# EAGLE design skull (EAGLE 5.10)
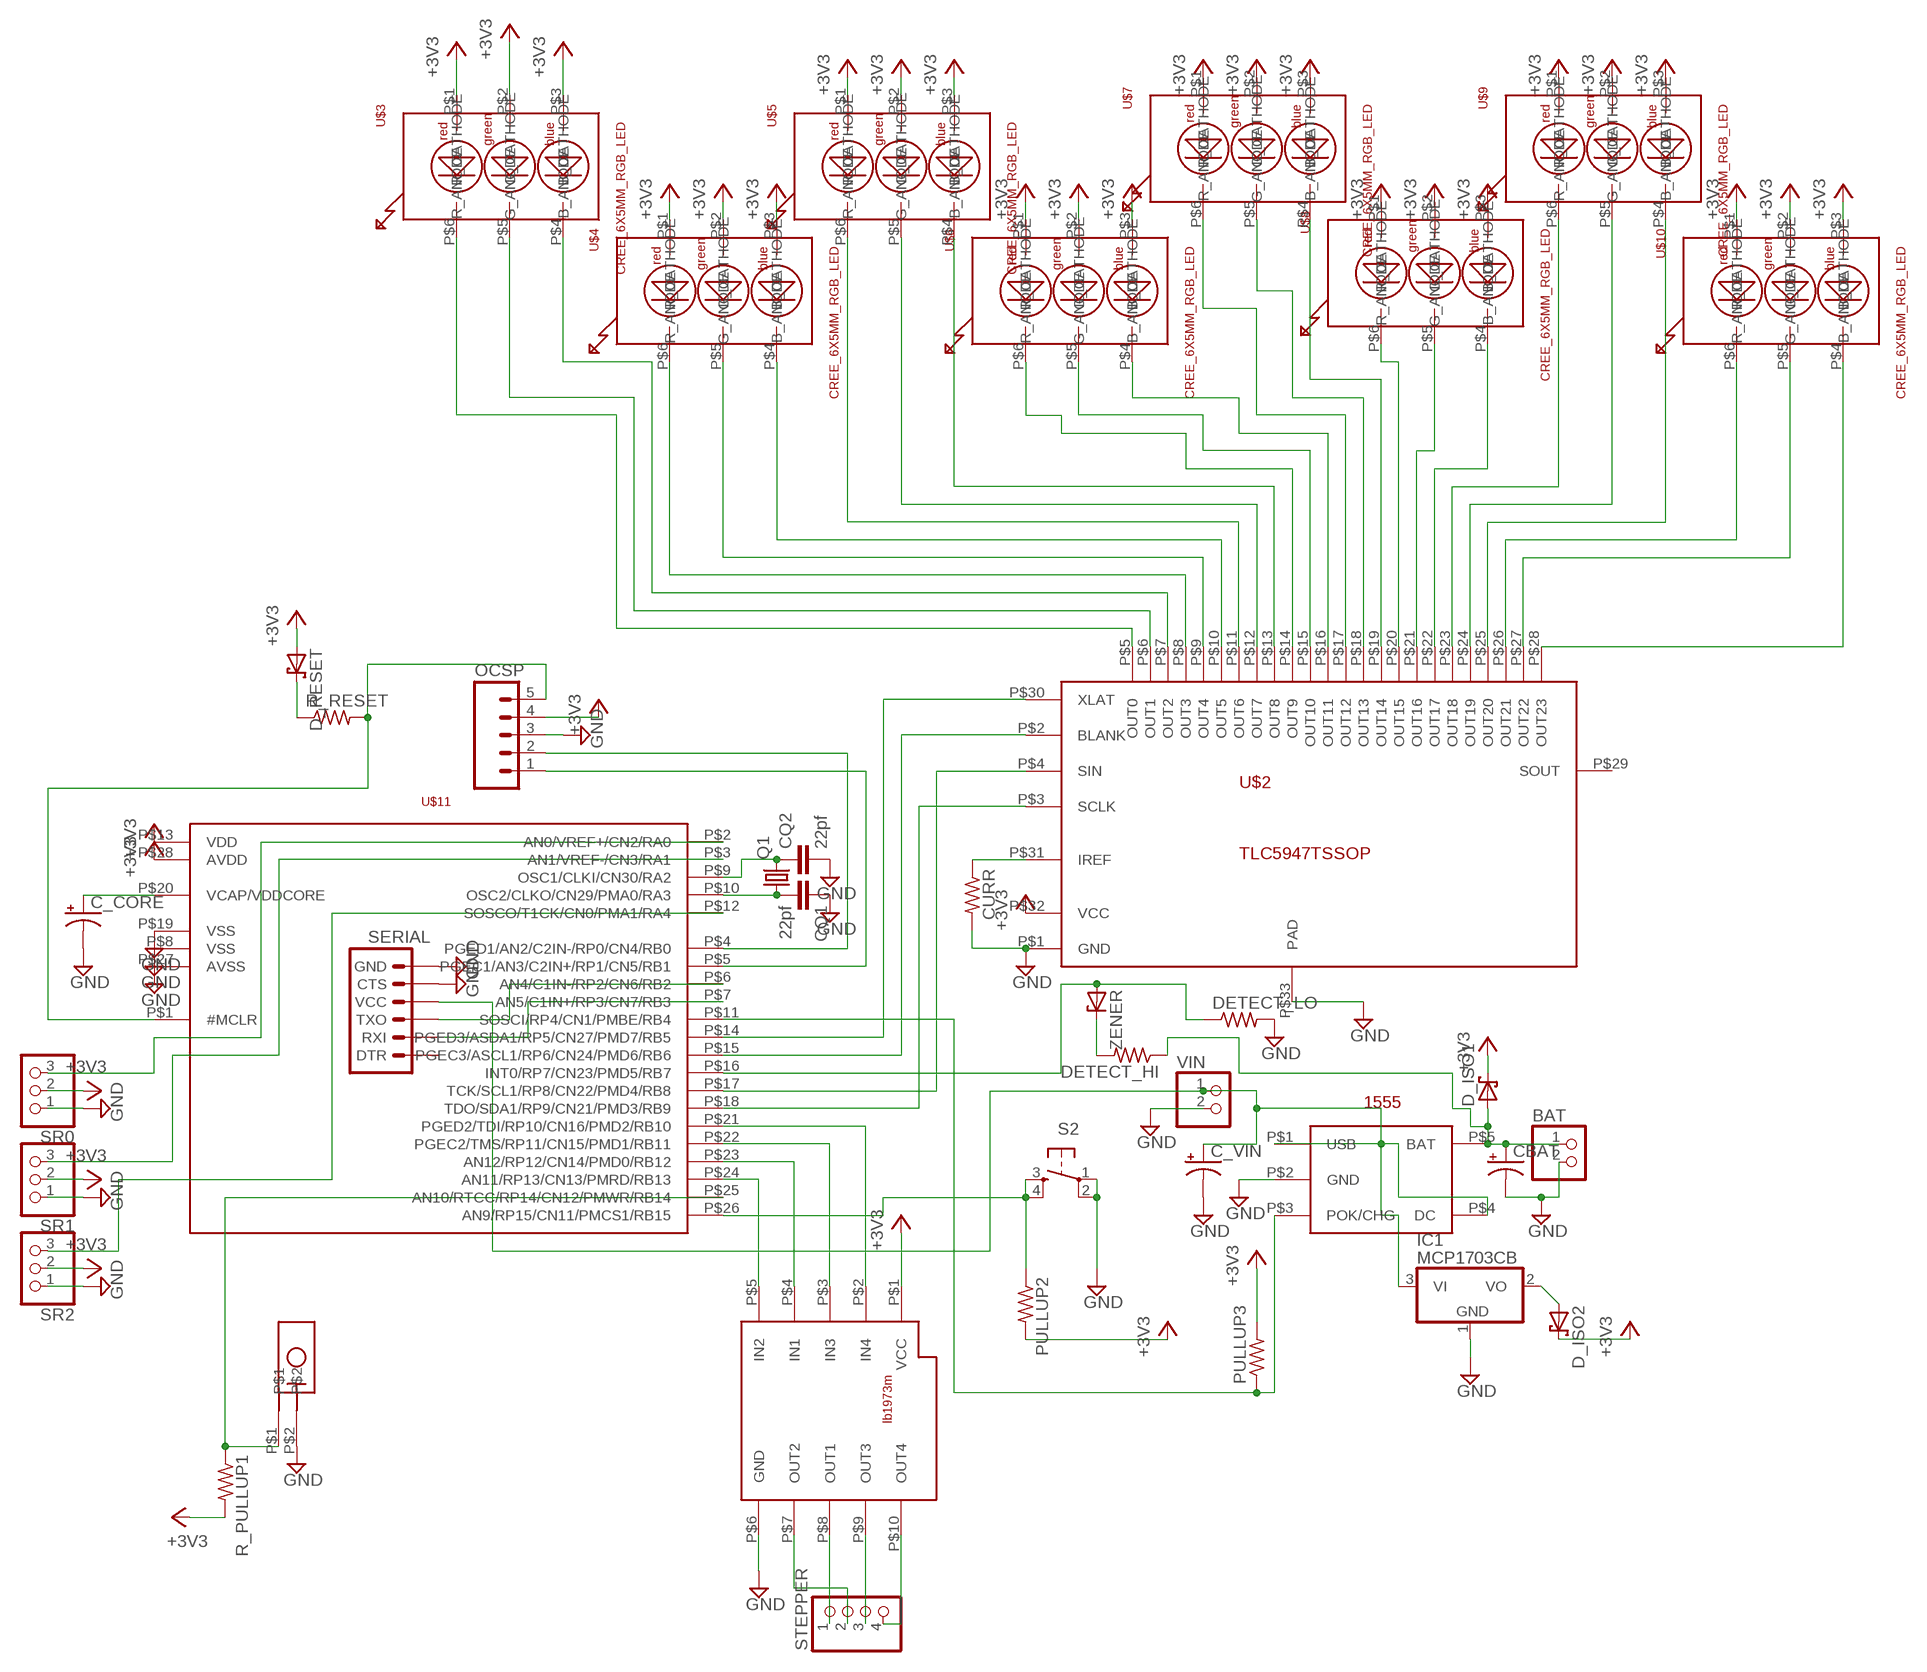
[diagram p0: schematic, sheet 1]

## Parts
BAT  PINHD-1X2  [1X02]
C_CORE  CAP_POL7343  [EIA7343]
C_VIN  CAP_POL7343  [EIA7343]
CBAT  CAP_POL7343  [EIA7343]
CQ1  22pf  CAP1206  [1206]
CQ2  22pf  CAP1206  [1206]
CURR  R-US_M1206  [M1206]
D_ISO1  SCHOTTKY-DIODESMD  [SMB]
D_ISO2  SCHOTTKY-DIODESMD  [SMB]
D_RESET  SCHOTTKY-DIODESMD  [SMB]
DETECT_HI  R-US_M1206  [M1206]
DETECT_LO  R-US_M1206  [M1206]
IC1  MCP1703CB  [SOT23]
OCSP  M05LOCK  [1X05_LOCK]
PULLUP2  R-US_M1206  [M1206]
PULLUP3  R-US_M1206  [M1206]
Q1  CRYSTALTC26V  [TC26V]
R_PULLUP1  R-US_M1206  [M1206]
R_RESET  R-US_M1206  [M1206]
S1  TILTSWITCH  [ROLLINGBALLTILT]
S2  TAC_SWITCHSMD  [TACTILE_SWITCH_SMD]
SERIAL  ARDUINO_SERIAL_PROGRAMPTH  [1X06]
SR0  PINHD-1X3  [1X03]
SR1  PINHD-1X3  [1X03]
SR2  PINHD-1X3  [1X03]
STEPPER  PINHD-1X4  [1X04]
U$1  MAX1555  [SOT23-5]
U$2  TLC5947TSSOP  [HTSSOP32-POWERPAD]
U$3  CREE_6X5MM_RGB_LED  [CREE_PLCC6_6X5MM]
U$4  CREE_6X5MM_RGB_LED  [CREE_PLCC6_6X5MM]
U$5  CREE_6X5MM_RGB_LED  [CREE_PLCC6_6X5MM]
U$6  CREE_6X5MM_RGB_LED  [CREE_PLCC6_6X5MM]
U$7  CREE_6X5MM_RGB_LED  [CREE_PLCC6_6X5MM]
U$8  CREE_6X5MM_RGB_LED  [CREE_PLCC6_6X5MM]
U$9  CREE_6X5MM_RGB_LED  [CREE_PLCC6_6X5MM]
U$10  CREE_6X5MM_RGB_LED  [CREE_PLCC6_6X5MM]
U$11  DSPIC33FJ128GP802  [SOIC_28_EX_WIDE]
U$13  LB1973M_DUAL_H_BRIDGESMT  [MFP10S_225MIL]
VIN  PINHD-1X2  [1X02]
ZENER  ZENER-DIODESMB  [SMB]

## Nets
+3V3 [power]: D_ISO1.C D_ISO2.C D_RESET.A OCSP.4 PULLUP2.2 PULLUP3.2 R_PULLUP1.2 SR0.2 SR1.2 SR2.2 U$2.P$32(VCC) U$3.P$1(R_ANODE) U$3.P$2(G_ANODE) U$3.P$3(B_ANODE) U$4.P$1(R_ANODE) U$4.P$2(G_ANODE) U$4.P$3(B_ANODE) U$5.P$1(R_ANODE) U$5.P$2(G_ANODE) U$5.P$3(B_ANODE) U$6.P$1(R_ANODE) U$6.P$2(G_ANODE) U$6.P$3(B_ANODE) U$7.P$1(R_ANODE) U$7.P$2(G_ANODE) U$7.P$3(B_ANODE) U$8.P$1(R_ANODE) U$8.P$2(G_ANODE) U$8.P$3(B_ANODE) U$9.P$1(R_ANODE) U$9.P$2(G_ANODE) U$9.P$3(B_ANODE) U$10.P$1(R_ANODE) U$10.P$2(G_ANODE) U$10.P$3(B_ANODE) U$11.P$13(VDD) U$11.P$28(AVDD) U$13.P$1(VCC)
GND [power]: BAT.2 C_CORE.C(-) C_VIN.C(-) CBAT.C(-) CQ1.1 CQ2.2 CURR.2 DETECT_LO.2 IC1.1(GND) OCSP.3 S1.P$2 S2.1 S2.2 SERIAL.5(CTS) SERIAL.6(GND) SR0.1 SR1.1 SR2.1 U$1.P$2(GND) U$2.P$1(GND) U$2.P$33(PAD) U$11.P$8(VSS) U$11.P$19(VSS) U$11.P$27(AVSS) U$13.P$6(GND) VIN.2
N$1: U$2.P$28(OUT23) U$10.P$4(B_CATHODE)
N$2: U$2.P$27(OUT22) U$10.P$5(G_CATHODE)
N$3: U$2.P$26(OUT21) U$10.P$6(R_CATHODE)
N$4: U$2.P$25(OUT20) U$9.P$4(B_CATHODE)
N$5: U$2.P$24(OUT19) U$9.P$5(G_CATHODE)
N$6: U$2.P$23(OUT18) U$9.P$6(R_CATHODE)
N$7: C_CORE.A(+) U$11.P$20(VCAP/VDDCORE)
N$8: CQ2.1 Q1.2 U$11.P$9(OSC1/CLKI/CN30/RA2)
N$9: CQ1.2 Q1.1 U$11.P$10(OSC2/CLKO/CN29/PMA0/RA3)
N$10: OCSP.1 U$11.P$5(PGEC1/AN3/C2IN+/RP1/CN5/RB1)
N$11: U$2.P$22(OUT17) U$8.P$4(B_CATHODE)
N$12: U$2.P$21(OUT16) U$8.P$5(G_CATHODE)
N$13: OCSP.2 U$11.P$4(PGED1/AN2/C2IN-/RP0/CN4/RB0)
N$14: U$2.P$20(OUT15) U$8.P$6(R_CATHODE)
N$15: U$2.P$19(OUT14) U$7.P$4(B_CATHODE)
N$16: U$2.P$18(OUT13) U$7.P$5(G_CATHODE)
N$17: U$2.P$17(OUT12) U$7.P$6(R_CATHODE)
N$18: U$2.P$16(OUT11) U$6.P$4(B_CATHODE)
N$19: U$2.P$15(OUT10) U$6.P$5(G_CATHODE)
N$20: U$2.P$14(OUT9) U$6.P$6(R_CATHODE)
N$21: OCSP.5 R_RESET.2 U$11.P$1(#MCLR)
N$22: PULLUP2.1 S2.3 S2.4 U$11.P$26(AN9/RP15/CN11/PMCS1/RB15)
N$23: D_RESET.C R_RESET.1
N$24: U$2.P$13(OUT8) U$5.P$4(B_CATHODE)
N$25: U$2.P$12(OUT7) U$5.P$5(G_CATHODE)
N$26: U$2.P$11(OUT6) U$5.P$6(R_CATHODE)
N$27: U$2.P$10(OUT5) U$4.P$4(B_CATHODE)
N$28: U$2.P$9(OUT4) U$4.P$5(G_CATHODE)
N$29: U$2.P$8(OUT3) U$4.P$6(R_CATHODE)
N$30: U$2.P$7(OUT2) U$3.P$4(B_CATHODE)
N$31: U$2.P$6(OUT1) U$3.P$5(G_CATHODE)
N$32: U$2.P$5(OUT0) U$3.P$6(R_CATHODE)
N$33: U$2.P$30(XLAT) U$11.P$14(PGED3/ASDA1/RP5/CN27/PMD7/RB5)
N$34: U$2.P$2(BLANK) U$11.P$15(PGEC3/ASCL1/RP6/CN24/PMD6/RB6)
N$35: U$2.P$3(SCLK) U$11.P$18(TDO/SDA1/RP9/CN21/PMD3/RB9)
N$36: U$2.P$4(SIN) U$11.P$17(TCK/SCL1/RP8/CN22/PMD4/RB8)
N$37: CURR.1 U$2.P$31(IREF)
N$38: D_ISO2.A IC1.2(VO)
N$40: U$11.P$21(PGED2/TDI/RP10/CN16/PMD2/RB10) U$13.P$2(IN4)
N$41: U$11.P$22(PGEC2/TMS/RP11/CN15/PMD1/RB11) U$13.P$3(IN3)
N$42: U$11.P$23(AN12/RP12/CN14/PMD0/RB12) U$13.P$4(IN1)
N$43: U$11.P$24(AN11/RP13/CN13/PMRD/RB13) U$13.P$5(IN2)
N$44: STEPPER.1 U$13.P$8(OUT1)
N$45: STEPPER.2 U$13.P$7(OUT2)
N$46: STEPPER.3 U$13.P$9(OUT3)
N$47: STEPPER.4 U$13.P$10(OUT4)
N$48: SERIAL.3(TXO) U$11.P$6(AN4/C1IN-/RP2/CN6/RB2)
N$49 [power]: C_VIN.A(+) IC1.3(VI) SERIAL.4(VCC) U$1.P$1(USB) U$1.P$4(DC) VIN.1
N$50: R_PULLUP1.1 S1.P$1 U$11.P$25(AN10/RTCC/RP14/CN12/PMWR/RB14)
N$51: SERIAL.2(RXI) U$11.P$7(AN5/C1IN+/RP3/CN7/RB3)
N$52: PULLUP3.1 U$1.P$3(POK/CHG) U$11.P$11(SOSCI/RP4/CN1/PMBE/RB4)
N$53: SR0.3 U$11.P$2(AN0/VREF+/CN2/RA0)
N$54: SR1.3 U$11.P$3(AN1/VREF-/CN3/RA1)
N$55: SR2.3 U$11.P$12(SOSCO/T1CK/CN0/PMA1/RA4)
N$70: BAT.1 CBAT.A(+) D_ISO1.A DETECT_HI.1 U$1.P$5(BAT)
N$72: DETECT_LO.1 U$11.P$16(INT0/RP7/CN23/PMD5/RB7) ZENER.A
N$73: DETECT_HI.2 ZENER.C
Unconnected: SERIAL.1(DTR) U$2.P$29(SOUT)

## Library data of the parts
BAT VIN = pinhead:PINHD-1X2: PIN HEADER
C_CORE C_VIN CBAT = SparkFun2011:CAP_POL: Capacitor Polarized These are standard SMD and PTH capacitors. Normally 10uF, 47uF, and 100uF in electrolytic and tantalum varieties. Always verify the external diameter of the through hole cap, it varies with capacity, voltage, and manufacturer. The EIA devices should be standard.
CQ1 CQ2 = SparkFun2011:CAP: Capacitor Standard 0603 ceramic capacitor, and 0.1" leaded capacitor.
CURR DETECT_HI DETECT_LO PULLUP2 PULLUP3 R_PULLUP1 R_RESET = resistor:R-US_: RESISTOR, American symbol
D_ISO1 D_ISO2 D_RESET = diode:SCHOTTKY-DIODE: Schottky Diode
IC1 = linear:MCP1703: 250 mA, 16V, Low Quiescent Current LDO Regulator Source: http://ww1.microchip.com/downloads/en/DeviceDoc/22049b.pdf
OCSP = SparkFun2011:M05: Header 5 Standard 5-pin 0.1" header. Use with straight break away headers (SKU : PRT-00116), right angle break away headers (PRT-00553), swiss pins (PRT-00743), machine pins (PRT-00117), and female headers (PRT-00115). Molex polarized connector foot print use with SKU : PRT-08230 with associated crimp pins and housings.
Q1 = crystal:CRYSTAL: CRYSTAL
S1 = RaphaelParts:TILTSWITCH
S2 = SparkFun2011:TAC_SWITCH: Momentary Switch Button commonly used for reset or general input. Spark Fun Electronics SKU : COM-00097
SERIAL = SparkFun2011:ARDUINO_SERIAL_PROGRAM
SR0 SR1 SR2 = pinhead:PINHD-1X3: PIN HEADER
STEPPER = pinhead:PINHD-1X4: PIN HEADER
U$1 = RaphaelBigLibrary:MAX1555
U$2 = RaphaelBigLibrary:TLC5947: TLC5947 led driver ic 24 channel current control
U$3-U$10 = RaphaelBigLibrary:CREE_6X5MM_RGB_LED
U$11 = RaphaelBigLibrary:DSPIC33FJ128GP802
U$13 = RaphaelBigLibrary:LB1973M_DUAL_H_BRIDGE
ZENER = diode:ZENER-DIODE: Z-Diode

## Net classes
0 default: width 0.254 mm, drill 0.635 mm, clearance 0.254 mm
1 power: width 0.508 mm, drill 0.991 mm, clearance 0.254 mm

## Board
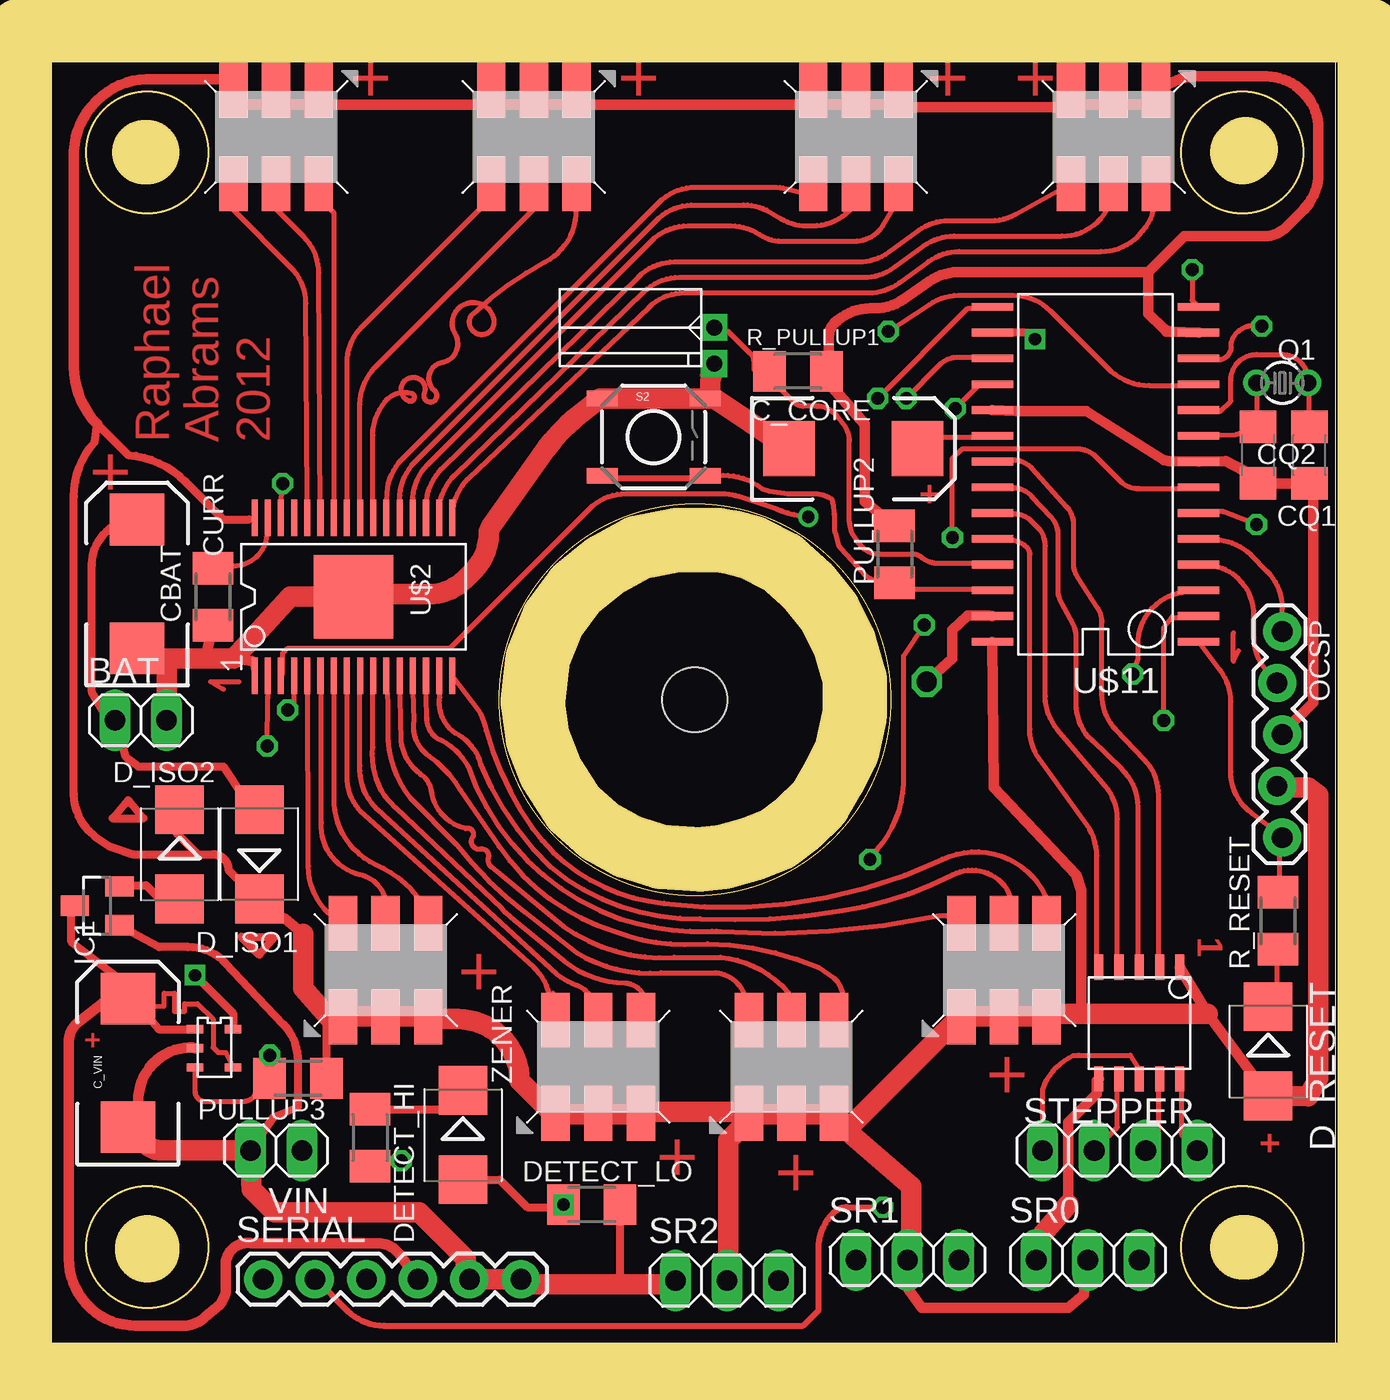
[diagram p1: board, top side]
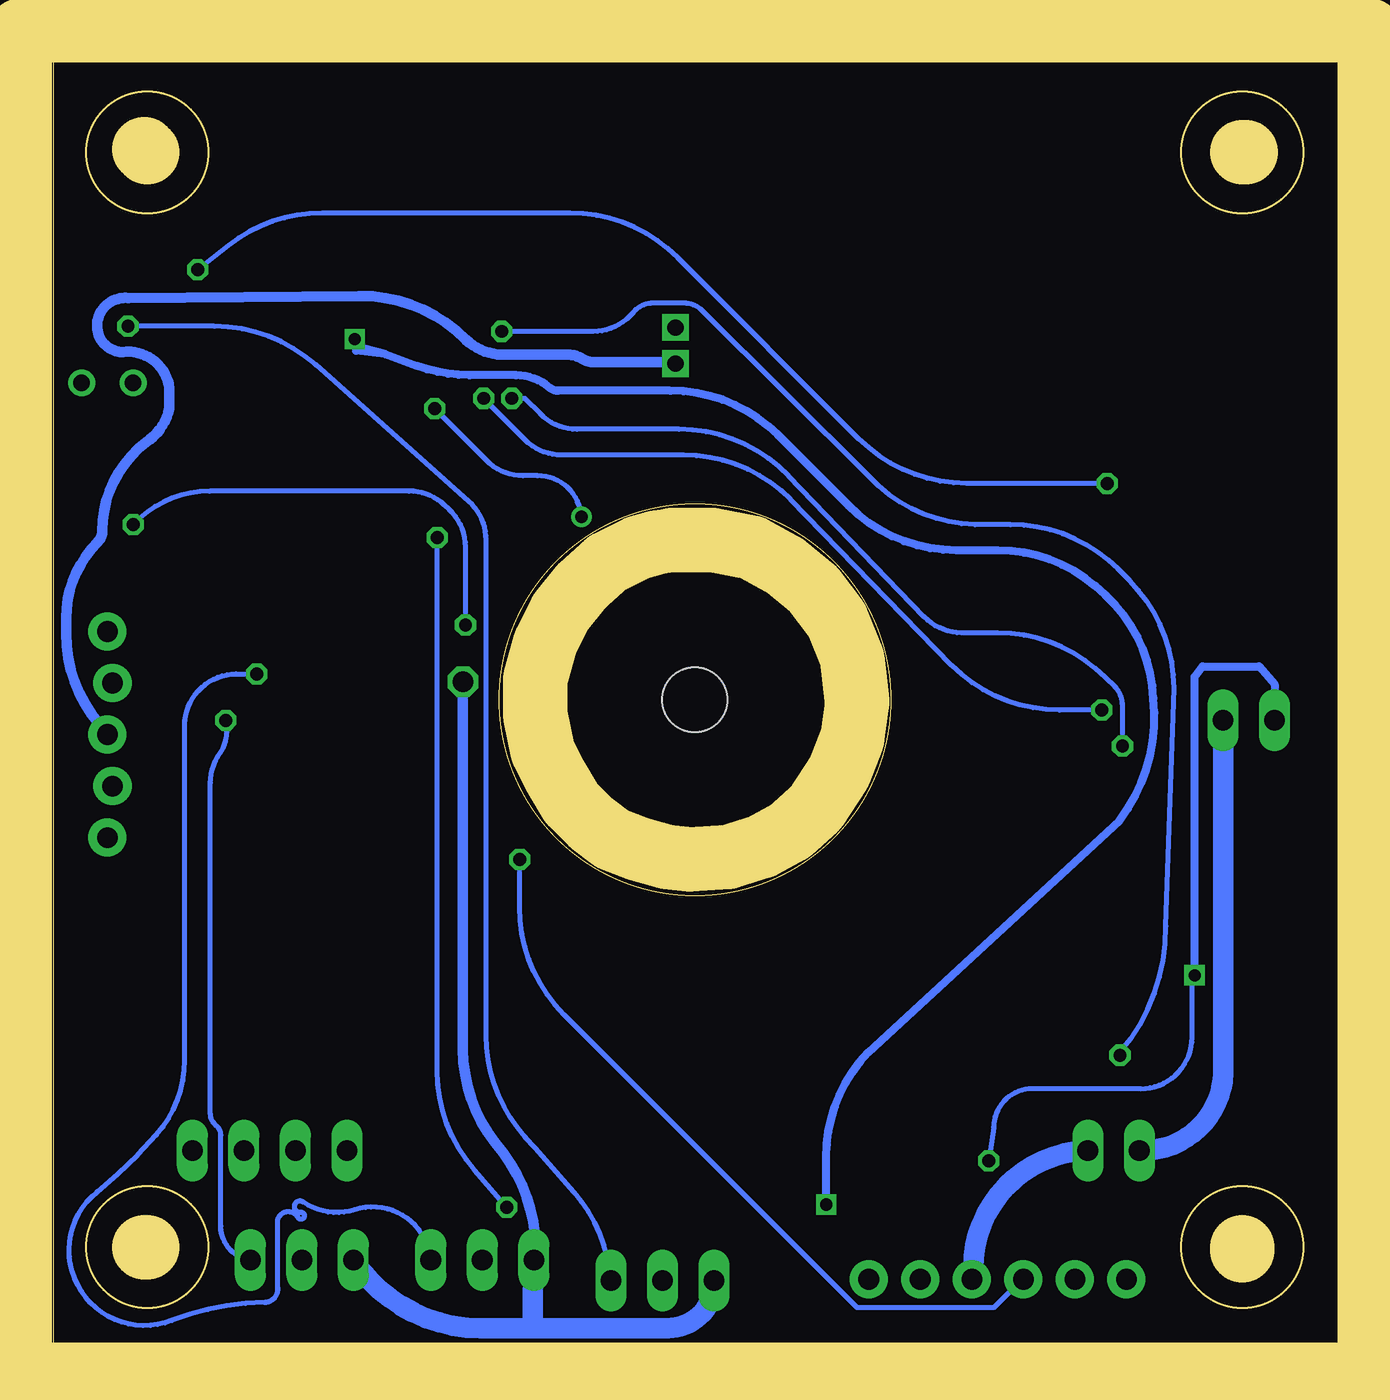
[diagram p2: board, bottom side, seen from below]

Size 63.35 x 63.23 mm. Coordinates in mm from the lower left corner, seen from the top.
Outline: 0,0 63.35,0 63.35,63.23 0,63.23 0,0
Outline: circle at 31.75,31.75 radius 9.65
Outline: circle at 4.76,58.74 radius 3
Outline: circle at 58.74,58.74 radius 3
Outline: circle at 58.74,4.76 radius 3
Outline: circle at 4.76,4.76 radius 3
Copper layers (1*16): Top 0.035mm / dielectric 1.5mm / Bottom 0.035mm
Design rules "default *": minimum track width 7mil, minimum drill 20mil, track to track 8mil, track to pad 8mil, pad to pad 8mil, via to via 8mil, smd to smd 0mil, copper to edge 10mil, drill to drill 8mil, minimum pad ring 10mil, minimum via ring 8mil, stop-mask expansion 4mil, vias tented up to drill 0mil, thermal gap 10mil
Holes 3.2 mm at 31.75,31.75
Holes 3 mm at 4.76,58.74 58.74,58.74 58.74,4.76 4.76,4.76
Milling: 38 lines

### Footprints (pad centres in the part's own frame; a part is rotated, then mirrored left to right if it is on the bottom)
1X02 = drill 1.016 long: 1 -1.27,0; 2 1.27,0
EIA7343 = smd 2.55 x 2.7: A 3.17,0; C -3.17,0
1206 = smd 1.6 x 1.8: 1 -1.4,0; 2 1.4,0
M1206 = smd 1.6 x 2: 1 -1.4,0; 2 1.4,0
SMB = smd 2.4 x 2.4: A 2.2,0; C -2.2,0
SOT23 = smd 1 x 1.4: 1 -0.95,-1.1; 2 0.95,-1.1; 3 0,1.1
1X05_LOCK = drill 1.016 pad 1.88 round: 1 0,0.127; 2 2.54,-0.127; 3 5.08,0.127; 4 7.62,-0.127; 5 10.16,0.127
TC26V = drill 0.813 round: 1 -1.27,0; 2 1.27,0
ROLLINGBALLTILT = drill 0.8 square: P$1 -0.635,0; P$2 -0.635,1.778
TACTILE_SWITCH_SMD = smd 1.524 x 0.762: 1 -2.54,1.905; 2 2.54,1.905; 3 -2.54,-1.905; 4 2.54,-1.905
1X06 = drill 1.016 pad 1.88 round: 1 0,0; 2 2.54,0; 3 5.08,0; 4 7.62,0; 5 10.16,0; 6 12.7,0
1X03 = drill 1.016 long: 1 -2.54,0; 2 0,0; 3 2.54,0
1X04 = drill 1.016 long: 1 -3.81,0; 2 -1.27,0; 3 1.27,0; 4 3.81,0
SOT23-5 = smd 0.813 x 0.406: P$1 -0.127,-0.559; P$2 -0.127,-1.499; P$3 -0.127,-2.438; P$4 1.753,-2.438; P$5 1.753,-0.559
HTSSOP32-POWERPAD = smd 1.8 x 0.3: P$1 -3.9,4.875; P$2 -3.9,4.225; P$3 -3.9,3.575; P$4 -3.9,2.925; P$5 -3.9,2.275; P$6 -3.9,1.625; P$7 -3.9,0.975; P$8 -3.9,0.325; P$9 -3.9,-0.325; P$10 -3.9,-0.975; P$11 -3.9,-1.625; P$12 -3.9,-2.275; P$13 -3.9,-2.925; P$14 -3.9,-3.575; P$15 -3.9,-4.225; P$16 -3.9,-4.875; P$17 3.9,-4.875; P$18 3.9,-4.225; P$19 3.9,-3.575; P$20 3.9,-2.925; P$21 3.9,-2.275; P$22 3.9,-1.625; P$23 3.9,-0.975; P$24 3.9,-0.325; P$25 3.9,0.325; P$26 3.9,0.975; P$27 3.9,1.625; P$28 3.9,2.275; P$29 3.9,2.925; P$30 3.9,3.575; P$31 3.9,4.225; P$32 3.9,4.875 | smd 4.11 x 3.91: P$33 0,0
CREE_PLCC6_6X5MM = smd 2.7 x 1.4: P$1 -2.3,2.1; P$2 -2.3,0; P$3 -2.3,-2.1; P$4 2.3,-2.1; P$5 2.3,0; P$6 2.3,2.1
SOIC_28_EX_WIDE = smd 2.032 x 0.381: P$1 -4.445,6.985; P$2 -4.445,5.715; P$3 -4.445,4.445; P$4 -4.445,3.175; P$5 -4.445,1.905; P$6 -4.445,0.635; P$7 -4.445,-0.635; P$8 -4.445,-1.905; P$9 -4.445,-3.175; P$10 -4.445,-4.445; P$11 -4.445,-5.715; P$12 -4.445,-6.985; P$13 -4.445,-8.255; P$14 -4.445,-9.525; P$15 5.715,-9.525; P$16 5.715,-8.255; P$17 5.715,-6.985; P$18 5.715,-5.715; P$19 5.715,-4.445; P$20 5.715,-3.175; P$21 5.715,-1.905; P$22 5.715,-0.635; P$23 5.715,0.635; P$24 5.715,1.905; P$25 5.715,3.175; P$26 5.715,4.445; P$27 5.715,5.715; P$28 5.715,6.985
MFP10S_225MIL = smd 1.25 x 0.45: P$1 -3,2; P$2 -3,1; P$3 -3,0; P$4 -3,-1; P$5 -3,-2; P$6 2.5,-2; P$7 2.5,-1; P$8 2.5,0; P$9 2.5,1; P$10 2.5,2

### Placement (x,y rotation side)
BAT  4.45,30.73 0 top
C_CORE  39.56,44.13 0 top
C_VIN  3.81,13.84 90 top
CBAT  4.25,37.47 90 top
CQ1  62.04,43.81 90 top
CQ2  59.5,43.81 270 top
CURR  8,36.83 270 top
D_ISO1  10.29,24.13 90 top
D_ISO2  6.35,24.13 270 top
D_RESET  60.01,14.41 270 top
DETECT_HI  15.75,10.16 90 top
DETECT_LO  26.67,6.86 0 top
IC1  2.29,21.59 90 top
OCSP  60.58,35.12 270 top
PULLUP2  41.59,38.93 90 top
PULLUP3  12.19,13.08 0 top
Q1  60.71,47.37 180 top
R_PULLUP1  36.83,47.94 0 top
R_RESET  60.49,20.85 90 top
S1  32.07,50.1 180 top
S2  29.72,44.7 0 top
SERIAL  10.48,3.17 0 top
SR0  51.12,4.13 0 top
SR1  42.23,4.13 0 top
SR2  33.34,3.11 0 top
STEPPER  52.7,9.53 0 top
U$1  7.24,16.07 0 top
U$2  14.92,36.83 90 top
U$3  16.51,18.41 90 top
U$4  26.99,13.65 90 top
U$5  36.51,13.65 90 top
U$6  46.99,18.41 90 top
U$7  52.39,59.5 270 top
U$8  39.69,59.5 270 top
U$9  23.81,59.5 270 top
U$10  11.11,59.5 270 top
U$11  52.13,41.59 180 top
U$13  53.66,15.56 270 top
VIN  11.11,9.53 180 top
ZENER  20.32,10.29 270 top

### Tracks (layer width: path | path; a pad name or v marks a point on that pad's centre or on a via)
+3V3
  Top 0.254: 9.78,40.64 U$2.P$32
  Top 0.406: PULLUP3.2 13.59,16.13 12.45,17.53 | 9.53,22.14 9.65,21.84 9.57,21.84 D_ISO1.C 9.67,22.04 arc-70 9.65,22.48 8.76,23.37 arc90 8,24.13 7.24,24.13 | 9.78,40.64 8.51,40.64 6.63,42.52 arc41 3.81,43.81 2.29,45.34 2.16,44.45 arc42 1.14,41.78 1.14,27.09 arc45 1.89,25.29 2.16,25.02 2.92,24.51 4.06,24.13 7.24,24.13 | 7.24,24.13 6.22,25.15 D_ISO2.C
  Top 0.508: PULLUP2.2 41.53,40.39 40.13,41.53 40.13,45.34 38.35,47.37 38.35,47.88 R_PULLUP1.2 38.35,48.13 38.35,49.65 arc-45 38.63,50.31 arc-45 40.42,51.05 40.6,51.05 arc35 42.06,51.51 43.29,52.37 arc-35 44.74,52.83 54.1,52.83 | U$11.P$13 55.24,49.91 55.12,49.91 | U$11.P$28 46.48,27.43 50.55,23.11 50.8,22.35 50.8,16.26 | 60.45,27.43 OCSP.4 60.33,27.3 60.33,27.43 | 44.96,16.13 U$6.P$1 44.7,16 | 46.99,16.13 U$6.P$2 47.12,16.13 | 49.02,16.13 U$6.P$3 49.28,16.26 | 57.02,16.26 59.94,12.32 D_RESET.A | 57.02,16.26 55.88,16.38 | 14.22,15.49 14.35,16 U$3.P$1 14.61,16.13 | 16.51,16.13 U$3.P$2 16.64,16.13 | 18.54,16.13 U$3.P$3 18.8,16 | 24.89,11.3 U$4.P$1 24.64,11.43 | 26.92,11.3 U$4.P$2 27.18,11.3 | 29.08,11.3 U$4.P$3 29.34,11.43 | U$5.P$1 34.42,11.3 | 36.45,11.3 U$5.P$2 | 38.61,11.3 U$5.P$3 | 33.4,2.92 SR2.2 | U$5.P$1 34.42,11.05 | 42.42,3.17 SR1.2 42.29,2.67 42.93,1.78 50.16,1.78 50.93,2.41 SR0.2 | U$5.P$3 38.61,11.05 | 34.16,11.43 U$5.P$1 | 9.65,21.84 11.56,20.95 12.45,20.19 | U$5.P$3 39.24,10.54 | 57.02,16.26 U$13.P$1 | 2.29,45.34 arc-44 1.14,48.16 1.14,58.8 arc-90 5.08,62.36 8.76,62.36 8.76,61.09 U$10.P$3 9.02,61.09 11.05,61.09 U$10.P$2 11.3,61.09 13.21,61.09 U$10.P$1 13.46,61.09 21.46,61.09 U$9.P$3 21.72,61.09 23.75,61.09 U$9.P$2 24,61.09 25.91,61.09 U$9.P$1 26.16,61.09 37.34,61.09 U$8.P$3 37.59,61.09 39.62,61.09 U$8.P$2 39.88,61.09 41.53,61.09 U$8.P$1 41.91,60.96 50.04,60.96 U$7.P$3 50.29,61.09 52.32,61.09 U$7.P$2 52.58,61.09 54.48,61.09 U$7.P$1 55.35,62.22 arc-26 56.47,62.48 59.91,62.48 arc-45 61.7,61.74 61.74,61.7 arc-45 62.48,59.91 62.48,57.69 arc-45 61.74,55.9 60.81,54.97 arc-45 59.53,54.61 55.88,54.61 54.1,52.83
  Top 0.508: 55.12,49.91 54.86,50.04 54.1,50.8 54.1,52.83 | 55.12,49.91 54.99,49.91
  Top 1.016: 60.33,27.43 60.45,27.43 61.98,27.43 62.48,27.05 62.48,13.08 61.98,12.19 D_RESET.A | 44.96,16.13 46.99,16.13 | 47.12,16.13 49.02,16.13 | 49.28,16.26 50.8,16.26 57.02,16.26 | 12.45,20.19 12.45,17.53 14.22,15.49 | 14.61,16.13 16.51,16.13 | 16.64,16.13 18.54,16.13 | 24.89,11.3 26.92,11.3 | 27.18,11.3 29.08,11.3 | 34.42,11.3 36.45,11.3 | 38.61,11.3 36.7,11.3 U$5.P$2 | 33.4,2.92 33.4,10.03 34.42,11.05 | 42.42,3.17 42.42,7.75 38.61,11.05 | 29.34,11.43 34.16,11.43 | 18.8,16 20.07,16 arc-90 23.11,12.95 24.64,11.43 | 39.24,10.54 44.7,16
GND  (via drill 0.99)
  Top 0.254: 9.91,33.66 U$2.P$1 | 27.05,46.61 S2.1 | 60.07,42.42 CQ2.2 | 61.59,42.42 CQ1.1
  Top 0.406: IC1.1 3.3,20.64 5.33,19.56 6.77,19.56 arc-47 8.63,18.75 9.78,17.53 11.49,15.72 arc-44 12.19,13.97 12.19,11.68 10.99,11.18 VIN.2 | DETECT_LO.2 28.07,3.04 28.19,2.92
  Top 0.508: 4.32,11.43 4.32,11.94 arc-90 6.86,14.61 6.99,14.61 U$1.P$2 | C_VIN.C 3.81,10.79 | 23.5,2.92 23.24,3.17 SERIAL.6 | 30.73,2.92 SR2.1 | 20.45,3.3 SERIAL.5 | 50.16,6.86 50.16,10.92 51.56,12.32 51.56,12.95 U$13.P$6 | SR0.1 48.51,4.95 | v43.18,32.64 44.45,33.78 44.45,35.18 45.21,35.9 46.23,35.9 U$11.P$27 | U$11.P$19 47.62,45.97 51.05,45.97 54.86,43.56 55.11,43.52 U$11.P$8 57.92,43.52 58.8,43.05 60.07,42.42 61.59,42.42 62.23,42.42 62.23,31.62 60.71,30.1 OCSP.3 | 32.51,46.61 32.64,47.88 | 32.64,47.88 32.26,47.75 S1.P$2 32.64,47.88 | 36.32,44.2 C_CORE.C | 9.02,33.78 9.91,33.66 | 7.62,33.78 CURR.2 | 3.43,33.78 CBAT.C | 5.71,33.78 5.84,33.78 | U$2.P$33 15.11,36.96 | 9.78,9.53 VIN.2 9.78,9.65 9.78,9.53
  Top 1.016: 3.81,10.79 4.32,11.43 4.32,10.67 arc90 5.46,9.53 9.78,9.53 9.91,7.62 11.05,6.48 18.16,6.48 20.45,4.19 20.45,3.3 | 23.5,2.92 28.19,2.92 30.73,2.92 | SERIAL.5 SERIAL.6 | 48.51,4.95 50.16,6.86 | 32.51,46.61 S2.2 27.05,46.61 25.81,45.6 arc16 24.43,44.12 21.72,40.31 arc35 21.59,39.91 arc-45 20.85,38.12 20.43,37.7 arc-45 18.63,36.96 15.11,36.96 | 32.64,47.88 32.51,47.5 32.51,46.74 36.32,44.2 | 5.84,33.78 7.62,33.78 9.02,33.78 11.81,36.83 U$2.P$33 | 3.43,33.78 5.71,33.78 BAT.2
  Bottom 0.508: v43.18,32.64 43.18,14.51 arc-38 41.6,9.91 41.2,9.4 arc38 39.62,4.79 39.62,2.92 SR1.1 39.75,2.67 | 48.51,4.06 SR0.1 | 39.62,0.76 39.75,0.89 | OCSP.3 60.71,30.1 arc45 62.74,35.01 62.74,35.79 arc45 61.19,39.52 arc-45 60.96,40.08 arc53 58.8,44.45 arc-45 57.66,46.13 57.66,47.12 arc-90 59.94,48.9 arc90 61.21,50.16 61.21,50.29 arc90 59.69,51.56 48.29,51.66 arc46 43.03,49.51 arc-45 41.24,48.77 38.02,48.77 arc27 37.45,48.63 37.23,48.52 arc-27 36.66,48.39 32.77,48.39 S1.P$2
  Bottom 1.016: 48.51,4.06 48.64,4.06 47.82,3.17 arc-47 42.31,0.76 39.62,0.76 33.08,0.76 arc-92 SR2.1 | 39.75,0.89 39.75,2.67 | BAT.2 5.71,13.72 arc94 9.65,9.53 VIN.2
N$1
  Top 0.254: U$2.P$28 12.64,41.61 12.58,51.29 arc45 11.84,53.06 9.02,55.88 9.02,56.39 U$10.P$4
N$2
  Top 0.254: U$2.P$27 13.29,40.82 13.21,52.81 arc45 12.47,54.59 11.18,55.88 11.18,56.39 U$10.P$5
N$3
  Top 0.254: U$2.P$26 13.97,40.77 13.97,55.75 13.34,56.39 U$10.P$6
N$4
  Top 0.254: U$2.P$25 14.61,40.77 14.61,48.35 arc-45 15.35,50.15 21.59,56.39 U$9.P$4
N$5
  Top 0.254: U$2.P$24 15.24,40.77 15.24,46.32 arc-45 15.98,48.12 23.75,55.88 23.75,56.39 U$9.P$5
N$6
  Top 0.254: U$2.P$23 15.88,40.77 15.88,44.8 arc-45 16.62,46.59 arc-58 17.78,46.86 arc-186 17.65,46.48 arc-174 18.03,47.62 arc-96 18.41,46.86 arc251 18.92,46.99 arc-129 19.3,48.39 arc111 19.94,49.78 arc-205 21.84,50.42 arc-233 20.83,50.8 arc-15 24.38,53.34 arc62 25.91,55.88 25.91,56.39 U$9.P$6
N$7
  Top 0.254: U$11.P$20 46.35,44.7 43.31,44.7 42.8,44.2 C_CORE.A
N$8
  Top 0.254: U$11.P$9 58.42,44.83 CQ2.1 Q1.2
N$9
  Top 0.254: CQ1.2 Q1.1 61.98,47.5 arc90 60.71,48.77 59.44,48.77 arc90 58.17,47.5 58.17,46.48 57.66,45.97 U$11.P$10
N$10
  Top 0.254: U$11.P$5 56.64,39.62 57.37,39.62 arc-45 59.16,38.88 59.96,38.08 arc-45 60.71,36.29 OCSP.1
N$11
  Top 0.254: U$2.P$22 16.55,41.53 16.58,41.96 arc-42 17.32,43.61 29.99,56.28 arc-45 31.79,57.02 35.63,57.02 arc-14 36.24,56.95 36.96,56.77 37.72,56.26 37.59,56.39 U$8.P$4
N$12
  Top 0.254: U$2.P$21 17.2,41.52 17.22,41.83 arc-42 17.96,43.48 29.99,55.52 arc-45 31.79,56.13 33.97,56.13 arc-31 35.27,55.9 35.97,55.48 arc31 37.28,55.12 37.56,55.12 arc45 39.35,55.86 39.88,56.39 39.12,55.88 39.62,56.39 U$8.P$5
N$13
  Top 0.254: U$11.P$4 56.64,38.35 56.99,38.35 arc-45 58.56,37.7 arc-45 59.31,35.91 59.31,34.83 arc45 60.05,33.04 60.45,32.64 OCSP.2
N$14
  Top 0.254: U$2.P$20 17.84,41.48 17.85,41.71 arc-42 18.59,43.35 29.61,54.37 arc-45 31.41,55.12 33.52,55.12 arc-34 34.93,54.69 arc34 36.04,54.36 39.6,54.36 arc56 41.02,55.12 41.78,56.39 U$8.P$6
N$15
  Top 0.254: U$2.P$19 18.52,41.39 arc-44 19.28,43.14 28.98,52.62 arc-44 30.75,53.34 39.81,53.34 arc36 41.31,53.83 42.77,54.89 arc-36 44.26,55.37 46.33,55.37 arc29 47.56,55.69 U$7.P$4
N$16
  Top 0.254: U$2.P$18 19.15,40.99 arc-46 19.92,42.84 29.23,51.86 arc-44 31,52.58 40.07,52.58 arc36 41.56,53.06 43.02,54.12 arc-36 44.51,54.61 49.84,54.61 arc88 52.38,57.05 U$7.P$5
N$17
  Top 0.254: U$2.P$17 19.8,40.84 arc-46 20.59,42.65 29.49,51.12 arc-44 31.24,51.82 40.32,51.82 arc36 41.82,52.3 43.27,53.36 arc-36 44.77,53.85 51.78,53.85 arc45 53.58,54.59 53.69,54.7 arc41 54.42,56.32 U$7.P$6
N$18
  Top 0.254: U$2.P$16 21.08,31.24 arc-21 21.46,30.23 arc19 23.75,25.4 arc48 30.23,21.72 arc32 43.94,23.88 arc-90 49.02,22.1 arc-46 U$6.P$4
N$19
  Top 0.254: U$2.P$15 19.18,31.88 arc63 19.94,30.1 arc-49 21.21,28.57 arc24 24.64,23.5 arc41 32,20.95 arc13 38.86,21.34 arc19 44.45,23.11 arc-77 46.99,22.61 arc-80 U$6.P$5
N$20
  Top 0.254: U$2.P$14 18.54,30.86 arc56 19.05,29.84 arc-39 20.57,28.45 arc51 28.07,20.95 arc19 32.38,20.32 arc-6 33.02,20.32 arc16 43.69,21.08 arc-58 U$6.P$6
N$21
  Top 0.254: R_RESET.2 60.58,22.35 60.58,24.77 60.71,24.89 OCSP.5 60.71,25.02 59.18,26.16 arc-53 58.17,28.19 58.17,31.66 arc37 57.65,33.19 U$11.P$1
N$22
  Top 0.254: S2.4 32.88,42.8 arc-45 35.04,42.17 35.44,42.03 36.32,41.91 37.64,41.91 arc-34 38.48,41.66 38.49,41.64 arc-17 38.62,40.89 38.63,40.29 arc29 38.67,39.98 38.82,39.41 arc21 38.94,39.22 40.01,38.04 arc50 40.98,37.59 41.53,37.59 PULLUP2.1 41.66,37.47 41.91,37.21 46.35,37.21 U$11.P$26
  Top 0.305: S2.3 27.12,42.72 arc-48 27.71,42.67 31.75,42.67 arc-61 32.44,42.59 S2.4
N$23
  Top 0.254: R_RESET.1 60.45,19.43 60.45,17.02 60.07,16.64 D_RESET.C
N$24
  Top 0.254: U$2.P$13 17.91,30.73 arc65 18.67,28.96 arc-24 20.19,27.3 22.1,24.51 arc38 27.81,20.32 arc21 31.24,19.68 arc-27 37.85,18.54 38.61,18.03 arc-93 U$5.P$4
N$25
  Top 0.254: U$2.P$12 17.27,29.72 arc51 18.41,27.94 arc-41 18.8,27.05 arc64 20.45,25.4 arc-127 20.83,25.02 arc144 21.21,24.38 arc-107 21.59,24 arc70 21.72,23.5 25.27,20.57 arc39 30.73,19.05 33.02,19.05 arc-49 36.58,17.02 arc-86 U$5.P$5
N$26
  Top 0.254: U$2.P$11 16.64,31.62 16.64,30.17 arc40 17.74,26.89 20,24.62 arc14 23.36,21.28 25.91,19.29 arc36 30.08,18.29 32.77,18.29 arc-90 34.29,16.51 34.29,16 U$5.P$6
N$27
  Top 0.254: U$2.P$10 15.88,32.89 15.88,29.41 arc40 16.47,27.01 17.02,26.42 22.25,21.44 arc7 22.85,20.86 25.3,18.88 arc38 28.32,17.78 arc-90 29.34,16.64 U$4.P$4
N$28
  Top 0.254: U$2.P$9 15.24,32.89 15.24,28.49 arc49 16.11,26.33 24.94,18.22 arc19 25.91,17.68 arc-46 26.82,16.77 26.92,16.51 26.92,16 U$4.P$5
N$29
  Top 0.254: 24.77,17.27 24.77,16 U$4.P$6 24.57,17.27 arc34 23.8,18.56 15.45,26.08 arc-48 14.61,27.96 14.61,32.89 U$2.P$8
N$30
  Top 0.254: U$2.P$7 13.97,32.89 13.97,26.96 arc67 16,23.62 arc-37 18.54,21.34 18.54,20.83 U$3.P$4
N$31
  Top 0.254: U$2.P$6 13.34,32.89 13.34,25.69 arc79 15.24,23.11 arc-90 16.51,21.21 U$3.P$5
N$32
  Top 0.254: U$2.P$5 12.66,32.89 12.7,23.54 arc62 U$3.P$6 14.35,20.83
N$33  (via drill 0.64)
  Top 0.254: v11.43,42.42 11.36,41.65 U$2.P$30 | v56.26,52.96 56.26,51.44 U$11.P$14
  Bottom 0.254: v11.43,42.42 18.36,42.42 arc45 23.66,44.62 32.6,53.56 arc-45 37.91,55.75 50.11,55.75 arc-38 54.74,54.15 v56.26,52.96
N$34  (via drill 0.64)
  Top 0.254: v10.67,29.46 10.7,31.85 10.71,32.03 U$2.P$2 | v40.77,46.61 45.21,51.05 46.35,51.05 U$11.P$15
  Bottom 0.254: v10.67,29.46 10.67,31.48 arc-45 11.04,32.38 11.52,32.85 | 11.52,32.85 11.56,32.89 | 11.52,32.85 arc-45 16.82,35.05 18.6,35.05 arc46 20.43,35.83 27.12,42.78 arc-46 32.53,45.09 37.56,45.09 arc45 39.35,45.83 40.13,46.61 v40.77,46.61
N$35  (via drill 0.6, 0.64)
  Top 0.254: v44.58,46.1 45.72,47.24 46.35,47.24 U$11.P$18 | U$2.P$3 11.43,33.02 11.43,34.04 11.68,34.29 19.68,34.29 26.56,41.17 arc-45 28.36,41.91 33.11,41.91 arc-18 33.91,41.78 35.76,41.17 arc10 36.63,40.88 v37.34,40.77
  Bottom 0.254: v37.34,40.77 arc-86 39.5,42.8 40.22,42.8 arc45 42.02,43.54 v44.58,46.1
N$36  (via drill 0.64)
  Top 0.254: v11.68,31.24 11.99,31.46 11.99,32.73 U$2.P$4 | v42.16,46.61 43.82,48.27 arc-45 44.72,48.64 46.35,48.64 U$11.P$17
  Bottom 0.254: v11.68,31.24 13.78,31.24 arc45 19.09,33.44 27.01,41.62 arc-45 32.32,43.81 38.32,43.81 arc45 40.11,44.56 v42.16,46.61
N$37
  Top 0.254: U$2.P$31 10.67,40.39 10.67,39.88 arc-85 9.01,38.35 7.62,38.35 CURR.1
N$38
  Top 0.406: D_ISO2.A 5.63,21.68 4.7,22.61 3.2,22.61 IC1.2
N$39
  Top 0.406: 3.81,26.8 3.81,26.67 | 3.81,26.8 3.05,25.91 4.57,25.91 3.81,26.8
N$40
  Top 0.254: U$13.P$2 54.61,18.67 54.61,27.05 arc44 53.91,28.8 52.52,30.25 arc-44 51.82,32.01 51.82,35.57 arc33 51.61,36.26 50.62,37.78 arc-33 50.42,38.48 50.42,40.41 arc42 50.09,41.26 48.38,43.14 arc48 47.44,43.56 46.35,43.56 U$11.P$21
N$41
  Top 0.254: U$13.P$3 53.59,18.67 53.59,26.48 arc46 52.81,28.31 51.33,29.73 arc-46 50.55,31.56 50.55,34.86 arc28 50.39,35.46 49.81,36.55 arc-28 49.66,37.15 49.66,39.89 arc43 49.32,40.75 48.36,41.78 arc45 47.48,42.19 U$11.P$22
N$42
  Top 0.254: U$13.P$4 52.58,18.67 52.58,25.86 arc40 51.98,27.51 49.62,30.28 arc-40 49.02,31.92 49.02,39.35 arc45 48.65,40.25 48.36,40.54 arc43 47.51,40.91 U$11.P$23
N$43
  Top 0.254: U$13.P$5 51.56,18.67 51.56,24.07 arc36 51.08,25.56 48.74,28.8 arc-36 48.26,30.29 48.26,38.92 arc45 48.12,39.25 arc45 47.23,39.62 46.48,39.62 U$11.P$24
N$44
  Top 0.254: STEPPER.1 48.9,12.54 arc-45 50.4,14.21 50.67,14.22 53.21,14.22 53.59,13.59 53.59,13.08 U$13.P$8
N$45
  Top 0.254: STEPPER.2 52.58,10.67 52.58,12.95 U$13.P$7
N$46
  Top 0.254: STEPPER.3 54.61,10.16 54.61,12.95 U$13.P$9
N$47
  Top 0.254: STEPPER.4 55.75,10.29 55.75,12.95 U$13.P$10
N$48  (via drill 0.64)
  Top 0.254: v59.44,40.39 57.78,41.02 56.52,41.02 U$11.P$6 | v43.05,35.43 42.04,33.91 42.04,27.59 arc-45 40.4,24.02 v40.39,23.88
  Bottom 0.254: v59.44,40.39 arc47 55.66,42.04 45.83,42.04 arc43 44.1,41.36 43.87,41.14 arc47 43.05,39.28 v43.05,35.43 | v40.39,23.88 40.39,21.52 arc-45 38.19,16.22 23.75,1.78 17.02,1.78 15.62,3.17 SERIAL.3
N$49
  Top 0.254: 3.81,17.78 4.84,16.75 | U$1.P$4 8.64,14.35 8.26,14.35 8,14.61 8,16 7.24,16.76 6.6,16.76 6.6,16.38 6.1,16.38 6.1,17.27 5.59,17.27 5.59,16.64 4.33,16.65
  Top 0.406: IC1.3 1.02,21.59 1.02,19.81 3.81,17.65 C_VIN.A 4.33,16.65 5.32,15.51 U$1.P$1
  Top 0.508: 3.55,17.57 1.38,15.88 arc52 0.89,14.88 0.89,4.19 arc90 4.19,0.89 6.41,0.89 arc49 7.62,1.33 8.33,1.93 arc41 8.64,2.76 8.64,4.06 arc-90 9.91,4.95 16.13,4.95 arc-53 17.14,4.45 SERIAL.4 | 3.55,17.57 3.81,17.78 | 3.55,17.57 3.68,17.4 C_VIN.A
  Bottom 0.508: SERIAL.4 18.03,3.17 | 12.45,9.53 VIN.1
  Bottom 1.016: 18.03,3.17 18.03,3.72 arc88 12.45,9.53
N$50
  Top 0.254: S1.P$1 32.77,49.91 33.4,49.91 34.48,48.83 arc-45 34.67,48.38 34.67,48.01 35.31,48.01 R_PULLUP1.1 35.43,47.88 35.81,47.88 35.81,47.24 36.64,46.41 arc45 37.09,46.23 37.74,46.23 arc-51 38.73,45.75 39.09,45.31 arc-39 39.37,44.51 39.37,40.52 arc34 39.59,39.81 39.8,39.49 arc56 40.85,38.94 42.5,38.94 arc-38 42.89,38.8 42.96,38.74 arc38 43.74,38.48 46.35,38.48 U$11.P$25
N$51  (via drill 0.64)
  Top 0.254: v44.45,39.75 44.45,43.67 44.93,44.12 50.63,44.12 arc-45 51.55,43.7 52.71,42.54 arc45 53.61,42.16 56.52,42.16 U$11.P$7 | 13.08,3.17 SERIAL.2
  Top 0.305: v41.02,6.73 39.25,6.73 arc45 38.59,6.46 arc45 37.85,4.66 37.85,1.65 37.08,0.89 16.42,0.89 arc-45 14.62,1.63 13.08,3.17
  Bottom 0.254: v41.02,6.73 42.61,8.55 arc41 44.45,13.48 v44.45,39.75
N$52  (via drill 0.64)
  Top 0.254: v10.79,14.22 10.03,12.19 arc-45 9.42,11.94 7.62,11.94 arc-90 7.11,12.45 U$1.P$3 | v41.27,49.91 43.28,51.22 arc-36 44.76,51.69 47.46,51.69 arc-45 49.26,50.95 52.09,48.12 arc45 54.14,47.24 56.77,47.24 U$11.P$11
  Top 0.406: PULLUP3.1 10.79,13.21 11.05,13.34 10.54,12.57 v10.79,14.22
  Bottom 0.254: v10.79,14.22 10.79,14.35 arc-41 8.54,20.58 8.13,32.33 arc-45 10.32,37.63 10.88,38.19 arc-45 16.19,40.39 17.95,40.39 arc45 23.16,42.74 31.38,50.94 arc-45 32.28,51.31 33.82,51.31 arc-51 34.8,50.84 arc51 36.76,49.91 v41.27,49.91
N$53  (via drill 0.64)
  Top 0.254: v54.86,30.73 54.86,35.31 55.24,35.81 56.52,35.81 U$11.P$2
  Bottom 0.254: v54.86,30.73 54.83,30.46 arc42 55.17,29.1 arc-35 55.63,27.65 55.63,11.31 arc-45 55.44,10.86 55.3,10.73 arc45 55.12,10.28 55.12,5.79 arc-83 SR0.3
N$54  (via drill 0.64)
  Top 0.254: v53.34,33.02 53.59,33.78 53.59,34.51 arc-50 54.49,36.45 54.53,36.48 arc-40 56.17,37.08 56.52,37.08 U$11.P$3
  Bottom 0.254: v53.34,33.02 54.36,33.02 arc-90 56.9,30.48 56.9,13.97 arc42 58.29,10.29 arc9 61.21,7.49 arc-162 57.53,1.14 arc20 52.96,2.03 arc-99 52.32,2.79 52.32,6.1 arc136 51.31,6.22 arc-246 51.18,6.48 arc221 51.05,6.99 arc-52 48.51,6.6 arc102 SR1.3
N$55  (via drill 0.64)
  Top 0.254: v59.69,50.16 59.44,50.16 arc90 58.17,49.28 arc-90 57.66,48.51 56.52,48.51 U$11.P$12
  Bottom 0.254: SR2.3 arc-37 37.7,7.46 39.62,9.65 40.1,10.18 arc42 42.04,15.21 42.04,39.63 arc-48 42.89,41.52 50.45,48.26 arc-42 55.44,50.16 v59.69,50.16
N$56
  Top 0.254: 58.29,35.05 58.29,33.66 58.55,34.16
N$57
  Top 0.254: 9.27,32.64 7.87,32.64 8.51,32.26
N$70  (via drill 0.6, 0.64)
  Top 0.254: v17.27,9.02 17.27,8.89 DETECT_HI.1
  Top 0.406: U$1.P$5 8.99,16.28 v7.11,18.16 | CBAT.A arc90 2.03,38.41 2.03,32.13 2.79,30.86 BAT.1 3.68,28.96 3.81,28.83 4.32,28.45 8.51,28.45 9.53,26.92 D_ISO1.A
  Bottom 0.254: v17.27,9.02 17.02,10.67 arc90 15.11,12.57 9.78,12.57 arc-90 7.24,15.11 7.24,18.03 v7.11,18.16
  Bottom 0.406: v7.11,18.16 7.11,32.89 6.73,33.4 3.94,33.4 3.17,32.51 BAT.1
N$71
  Top 0.406: 9.4,20.07 10.29,19.18 11.05,20.07 9.4,20.07
N$72  (via drill 0.6)
  Top 0.406: ZENER.A 22.14,8.09 23.5,6.73 25.14,6.73 DETECT_LO.1 | U$11.P$16 48.2,49.85 v48.51,49.53
  Bottom 0.406: DETECT_LO.1 25.27,9.19 arc44 23.2,14.37 10.82,25.8 arc-44 9.14,31.82 arc-45 11.47,36.87 11.52,36.92 arc-45 16.82,39.12 18.86,39.12 arc45 24.17,41.31 27.65,44.79 arc-45 32.95,46.99 38.5,46.99 arc41 38.91,47.14 arc-41 40.56,47.75 42.87,47.75 arc20 45.45,48.21 47.01,48.78 | 47.01,48.78 48.45,48.96 | v48.51,49.53 48.51,49.18 47.01,48.78
  other vias: 25.27,6.86
N$73
  Top 0.406: DETECT_HI.2 20.32,11.56 ZENER.C

### Text on the board
Top: + | + | + | + | Raphael | Abrams | 2012 | + | + | 1 | + | + | + | + | + | +